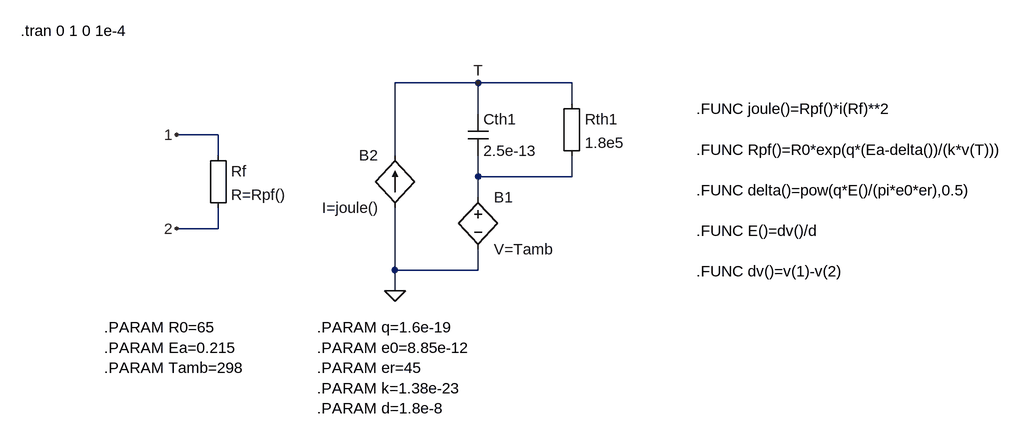
[diagram p0: schematic 原始论文神经元.asc]
原始论文神经元.asc, the LTspice schematic file:
Version 4
SHEET 1 880 680
WIRE -112 -320 -240 -320
WIRE 32 -320 -112 -320
WIRE 32 -288 32 -320
WIRE -112 -272 -112 -320
WIRE -512 -240 -576 -240
WIRE -512 -208 -512 -240
WIRE -240 -208 -240 -320
WIRE -112 -176 -112 -208
WIRE 32 -176 32 -208
WIRE 32 -176 -112 -176
WIRE -112 -144 -112 -176
WIRE -512 -96 -512 -128
WIRE -512 -96 -576 -96
WIRE -240 -32 -240 -128
WIRE -112 -32 -112 -64
WIRE -112 -32 -240 -32
WIRE -240 0 -240 -32
FLAG -240 0 0
FLAG -112 -320 T
FLAG -576 -240 1
FLAG -576 -96 2
SYMBOL cap -128 -272 R0
SYMATTR InstName Cth1
SYMATTR Value 2.5e-13
SYMBOL Misc\\EuropeanResistor 16 -304 R0
SYMATTR InstName Rth1
SYMATTR Value 1.8e5
SYMBOL Misc\\EuropeanResistor -528 -224 R0
SYMATTR InstName Rf
SYMATTR Value R=Rpf()
SYMBOL bv -112 -160 R0
SYMATTR InstName B1
SYMATTR Value V=Tamb
SYMBOL bi -240 -128 R180
WINDOW 0 26 81 Left 2
WINDOW 3 24 0 Left 2
SYMATTR InstName B2
SYMATTR Value I=joule()
TEXT 224 -280 Left 2 !.FUNC joule()=Rpf()*i(Rf)**2\n \n.FUNC Rpf()=R0*exp(q*(Ea-delta())/(k*v(T)))\n \n.FUNC delta()=pow(q*E()/(pi*e0*er),0.5)\n \n.FUNC E()=dv()/d\n \n.FUNC dv()=v(1)-v(2)
TEXT -688 56 Left 2 !.PARAM R0=65\n.PARAM Ea=0.215\n.PARAM Tamb=298
TEXT -816 -400 Left 2 !.tran 0 1 0 1e-4
TEXT -360 56 Left 2 !.PARAM q=1.6e-19 \n.PARAM e0=8.85e-12 \n.PARAM er=45 \n.PARAM k=1.38e-23 \n.PARAM d=1.8e-8

The netlist it stands for:
* 原始论文神经元.asc
Cth1 T N001 2.5e-13
Rth1 T N001 1.8e5
Rf 1 2 R=Rpf()
B1 N001 0 V=Tamb
B2 0 T I=joule()
.FUNC joule()=Rpf()*i(Rf)**2
.FUNC Rpf()=R0*exp(q*(Ea-delta())/(k*v(T)))
.FUNC delta()=pow(q*E()/(pi*e0*er),0.5)
.FUNC E()=dv()/d
.FUNC dv()=v(1)-v(2)
.PARAM R0=65
.PARAM Ea=0.215
.PARAM Tamb=298
.tran 0 1 0 1e-4
.PARAM q=1.6e-19
.PARAM e0=8.85e-12
.PARAM er=45
.PARAM k=1.38e-23
.PARAM d=1.8e-8
.backanno
.end